# Altium schematic sheet YarnControl_motor_v1.0.SchDoc
size A3
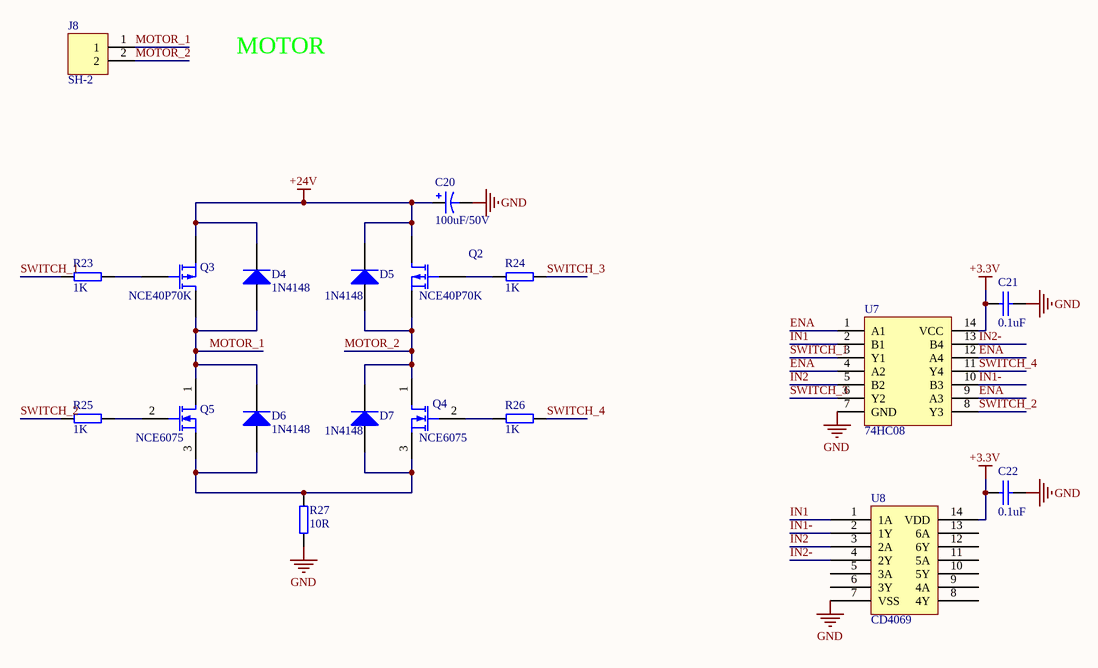
[diagram p0: YarnControl_motor_v1.0.SchDoc]

## Parts
C20  100uF/50V  [CAP-5mm]
C21  0.1uF  [0805]
C22  0.1uF  [0805]
D4  1N4148  [DIDODE_LL-34]
D5  1N4148  [DIDODE_LL-34]
D6  1N4148  [DIDODE_LL-34]
D7  1N4148  [DIDODE_LL-34]
J8  SH-2  [CH3.96-2P]
Q2  NCE40P70K  [TO-252]
Q3  NCE40P70K  [TO-252]
Q4  NCE6075  [TO-252]
Q5  NCE6075  [TO-252]
R23  1K  [0805]
R24  1K  [0805]
R25  1K  [0805]
R26  1K  [0805]
R27  10R  [1210]
U7  74HC08  [SO-14]
U8  CD4069  [SO-14]

## Nets
+3.3V: C21.1 C22.1 U7.14(VCC) U8.14(VDD)
+24V: C20.1 D4.2(K) D5.2(K) Q2.1(D) Q3.3(S)
GND: C20.2 C21.2 C22.2 R27.1 U7.7(GND) U8.7(VSS)
ENA: U7.1(A1) U7.4(A2) U7.9(A3) U7.12(A4)
IN1: U7.2(B1) U8.1(1A)
IN1-: U7.10(B3) U8.2(1Y)
IN2: U7.5(B2) U8.3(2A)
IN2-: U7.13(B4) U8.4(2Y)
MOTOR_1: D4.1(A) D6.2(K) J8.1 Q3.1(D) Q5.1(D)
MOTOR_2: D5.1(A) D7.2(K) J8.2 Q2.3(S) Q4.1(D)
SWITCH_1: R23.1 U7.3(Y1)
SWITCH_2: R25.1 U7.8(Y3)
SWITCH_3: R24.2 U7.6(Y2)
SWITCH_4: R26.2 U7.11(Y4)
NetD6_1: D6.1(A) D7.1(A) Q4.3(S) Q5.3(S) R27.2
NetQ2_2: Q2.2(G) R24.1
NetQ3_2: Q3.2(G) R23.2
NetQ4_2: Q4.2(G) R26.1
NetQ5_2: Q5.2(G) R25.2

Not connected (* = marked no-connect by the designer): U8 5(3A) 6(3Y) 8(4Y) 9(4A) 10(5Y) 11(5A) 12(6Y) 13(6A)

## Notes on the sheet
- MOTOR

## Library data of the parts
C20 = Cap Pol1: Polarized Capacitor (Radial); Published: 8-Jun-2000; LatestRevisionDate: 17-Jul-2002; LatestRevisionNote: Re-released for DXP Platform.; PackageReference: RB7.6-15; Publisher: Altium Limited
C21 C22 = CAP: 电容
D4-D7 = Diode: Default Diode; Published: 8-Jun-2000; LatestRevisionDate: 17-Jul-2002; LatestRevisionNote: Re-released for DXP Platform.; PackageVersion: Sep-1996; PackageReference: SMC; Publisher: Altium Limited; Code_JEDEC: DO-214-AB
Q2 Q3 = MOSFET-P: P-Channel MOSFET; Published: 8-Jun-2000; LatestRevisionDate: 17-Jul-2002; LatestRevisionNote: Re-released for DXP Platform.; PackageVersion: 1995/1996; PackageReference: E3; Publisher: Altium Limited
Q4 Q5 = MOSFET-N: N-Channel MOSFET; Published: 8-Jun-2000; LatestRevisionDate: 17-Jul-2002; LatestRevisionNote: Re-released for DXP Platform.; PackageVersion: 1995/1996; PackageReference: E3; Publisher: Altium Limited
R23-R27 = RES: 电阻